# Altium schematic sheet 02-Inputs_Outputs.SchDoc
size Letter
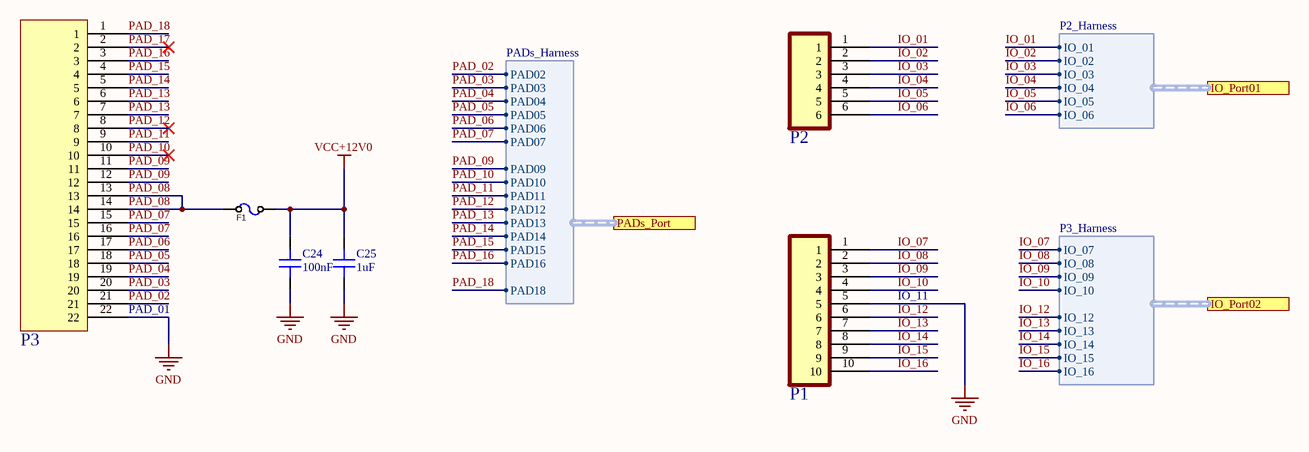
[diagram p0: 02-Inputs_Outputs.SchDoc]

## Parts
C24  100nF  [Cap0805]
C25  1uF  [Cap0805]
F1  PPTC-FUSE-30V1.1A  [RXEF250]  (value not drawn)
P1  PWR_HDR_10P  [PWR_HDR_10P]  (value not drawn)
P2  PWR_HDR_6P  [PWR_HDR_6P]  (value not drawn)
P3  PCI  [PCI]  (value not drawn)

## Ports
IO_Port01 (harness P2_Harness), IO_Port02 (harness P3_Harness), PADs_Port (harness PADs_Harness)

## Harnesses
PADs_Harness: PAD02, PAD03, PAD04, PAD05, PAD06, PAD07, PAD09, PAD10, PAD11, PAD12, PAD13, PAD14, PAD15, PAD16, PAD18
P2_Harness: IO_01, IO_02, IO_03, IO_04, IO_05, IO_06
P3_Harness: IO_07, IO_08, IO_09, IO_10, IO_12, IO_13, IO_14, IO_15, IO_16

## Nets
GND: C24.1 C25.1 P1.5 P3.22
VCC+12V0: C24.2 C25.2 F1.2
IO_01: P2.1 ; port IO_Port01.IO_01
IO_02: P2.2 ; port IO_Port01.IO_02
IO_03: P2.3 ; port IO_Port01.IO_03
IO_04: P2.4 ; port IO_Port01.IO_04
IO_05: P2.5 ; port IO_Port01.IO_05
IO_06: P2.6 ; port IO_Port01.IO_06
IO_07: P1.1 ; port IO_Port02.IO_07
IO_08: P1.2 ; port IO_Port02.IO_08
IO_09: P1.3 ; port IO_Port02.IO_09
IO_10: P1.4 ; port IO_Port02.IO_10
IO_12: P1.6 ; port IO_Port02.IO_12
IO_13: P1.7 ; port IO_Port02.IO_13
IO_14: P1.8 ; port IO_Port02.IO_14
IO_15: P1.9 ; port IO_Port02.IO_15
IO_16: P1.10 ; port IO_Port02.IO_16
PAD_02: P3.21 ; port PADs_Port.PAD02
PAD_03: P3.20 ; port PADs_Port.PAD03
PAD_04: P3.19 ; port PADs_Port.PAD04
PAD_05: P3.18 ; port PADs_Port.PAD05
PAD_06: P3.17 ; port PADs_Port.PAD06
PAD_07: P3.15 P3.16 ; port PADs_Port.PAD07
PAD_08: F1.1 P3.13 P3.14
PAD_09: P3.11 P3.12 ; port PADs_Port.PAD09
PAD_10: P3.10 ; port PADs_Port.PAD10
PAD_11: P3.9 ; port PADs_Port.PAD11
PAD_12: P3.8 ; port PADs_Port.PAD12
PAD_13: P3.6 P3.7 ; port PADs_Port.PAD13
PAD_14: P3.5 ; port PADs_Port.PAD14
PAD_15: P3.4 ; port PADs_Port.PAD15
PAD_16: P3.3 ; port PADs_Port.PAD16
PAD_17: P3.2
PAD_18: P3.1 ; port PADs_Port.PAD18

## Notes on the sheet
- (near P3) PAD_01
- IO_11

## Library data of the parts
C24 = Cap-0805-100nF: Cap 0805 100nF; Manufacturer: ---; ID: 51; Additionner: S.Pourmohammad; Part Number: Cap-0805-100nF; Category: Cap; Sub-Category: Cer0805; Adding Time: 1402-05-18; Datasheet Path: ---; Supplier: Ic Kala
C25 = Cap-0805-1uF: Cap 0805 1uF; Manufacturer: ---; ID: 50; Additionner: S.Pourmohammad; Part Number: Cap-0805-1uF; Category: Cap; Sub-Category: Cer0805; Adding Time: 1402-05-18; Datasheet Path: ---; Supplier: Ic Kala
F1 = PPTC-FUSE-30V1.1A: Polymeric PTC Resettable Fuse 30V 1.1A Through Hole Radial, Disc; PARAM: 1A; 125VDC; fast acting; MANF: Reomax; MANF_P#: SFE1100; PARAM2: 0.25 Ohm DC Cold Resistance; ID: 117; Additionner: A.Abdolahzadeh; PRICE: 260toman@Javan; Part Number: PPTC-FUSE-30V1.1A; Category: Fuse; Sub-Category: PPTC; Adding Time: 1402-10-13
P1 = Power Connector 10 Pin: P-P= 3.96mm; ID: 101; Additionner: S.Pourmohammad; Part Number: Power Connector 10 Pin; Category: Connector; Sub-Category: Power Connector; Adding Time: 1402-10-1
P2 = Power Connector 6 Pin: P-P= 3.96mm; ID: 100; Additionner: S.Pourmohammad; Part Number: Power Connector 6 Pin; Category: Connector; Sub-Category: Power Connector; Adding Time: 1402-10-1
P3 = PCI: normal PAD for SPARK project; ID: 81; Additionner: S.Pourmohammad; Part Number: PCI; Category: Connector; Sub-Category: PCI; Adding Time: 1402-10-1